# Altium schematic sheet MUX.SchDoc
size B
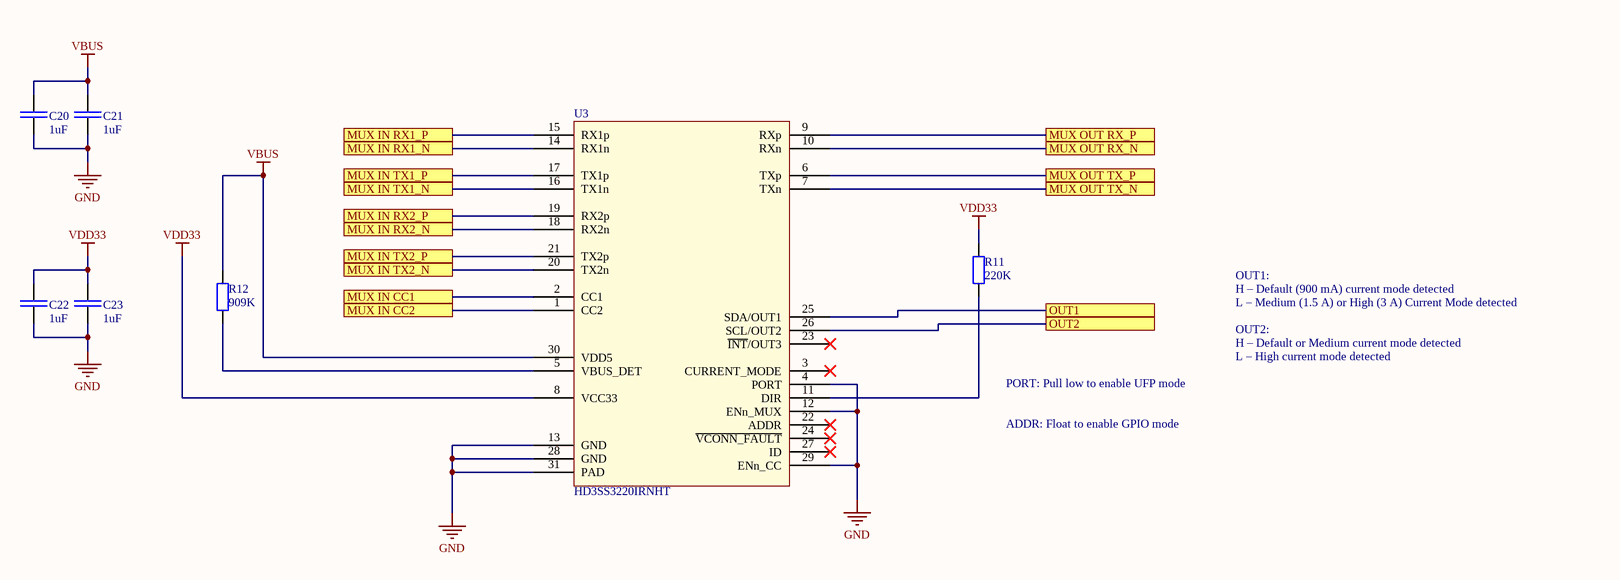
[diagram p0: MUX.SchDoc]

## Parts
C20  1uF  [CAP_SM0805_YAGEOCC2_N]
C21  1uF  [CAP_SM0805_YAGEOCC2_N]
C22  1uF  [CAP_SM0805_YAGEOCC2_N]
C23  1uF  [CAP_SM0805_YAGEOCC2_N]
R11  220K  [RES_SM0603_YAGEORC_N]
R12  909K  [RES_SM0603_YAGEORC_N]
U3  HD3SS3220IRNHT  [QFN40P250X450X80_HS-31N - HD3SS3220IRNHT]

## Ports
MUX IN CC1, MUX IN CC2, MUX IN RX1_N, MUX IN RX1_P, MUX IN RX2_N, MUX IN RX2_P, MUX IN TX1_N, MUX IN TX1_P, MUX IN TX2_N, MUX IN TX2_P, MUX OUT RX_N, MUX OUT RX_P, MUX OUT TX_N, MUX OUT TX_P, OUT1, OUT2

## Nets
GND: C20.2 C21.2 C22.2 C23.2 U3.4(PORT) U3.12(ENn_MUX) U3.13(GND) U3.28(GND) U3.29(ENn_CC) U3.31(PAD)
VBUS: C20.1 C21.1 R12.2 U3.30(VDD5)
VDD33: C22.1 C23.1 R11.2 U3.8(VCC33)
MUX IN CC1: U3.2(CC1) ; port MUX IN CC1
MUX IN CC2: U3.1(CC2) ; port MUX IN CC2
MUX IN RX1_N: U3.14(RX1n) ; port MUX IN RX1_N
MUX IN RX1_P: U3.15(RX1p) ; port MUX IN RX1_P
MUX IN RX2_N: U3.18(RX2n) ; port MUX IN RX2_N
MUX IN RX2_P: U3.19(RX2p) ; port MUX IN RX2_P
MUX IN TX1_N: U3.16(TX1n) ; port MUX IN TX1_N
MUX IN TX1_P: U3.17(TX1p) ; port MUX IN TX1_P
MUX IN TX2_N: U3.20(TX2n) ; port MUX IN TX2_N
MUX IN TX2_P: U3.21(TX2p) ; port MUX IN TX2_P
MUX OUT RX_N: U3.10(RXn) ; port MUX OUT RX_N
MUX OUT RX_P: U3.9(RXp) ; port MUX OUT RX_P
MUX OUT TX_N: U3.7(TXn) ; port MUX OUT TX_N
MUX OUT TX_P: U3.6(TXp) ; port MUX OUT TX_P
OUT1: U3.25(SDA/OUT1) ; port OUT1
OUT2: U3.26(SCL/OUT2) ; port OUT2
NetR11_1: R11.1 U3.11(DIR)
NetR12_1: R12.1 U3.5(VBUS_DET)

Not connected (* = marked no-connect by the designer): U3 3(CURRENT_MODE)* 22(ADDR)* 23(~{INT}/OUT3)* 24(~{VCONN_FAULT})* 27(ID)*

## Notes on the sheet
- OUT1:
- H – Default (900 mA) current mode detected
- L – Medium (1.5 A) or High (3 A) Current Mode detected
- PORT: Pull low to enable UFP mode
- OUT2:
- H – Default or Medium current mode detected
- L – High current mode detected
- ADDR: Float to enable GPIO mode

## Library data of the parts
C20-C23 = CC0805KKX7R8BB105: CAP 1uF SM0805 X7R 25V YAGEO CC2; Tolerance (%): 10; Voltage Rating (Volts): 25; Category: Capacitor; Manufacturer: Yageo; Manufacturer Part Number: CC0805KKX7R8BB105; Package: 0805; Value: 1uF; Supplier Part Number 1: 1458903; Supplier 1: Farnell; ComponentLink1URL: http://www.yageo.com; ComponentLink1Description: Manufacturer Website; Supplier 2: Digi-Key; Supplier Part Number 2: 311-1456-1-ND
R11 = RC0603FR-07220KL: RES 220K SM0603 YAGEO RC_L; Power (Watts): 0.1; Resistance (Ohms): 220000; Tolerance (%): 1; Category: Resistor; Manufacturer: Yageo; Manufacturer Part Number: RC0603FR-07220KL; Package: 0603; Value: 220K; Supplier Part Number 1: 9238760; Supplier 1: Farnell; ComponentLink1URL: http://www.yageo.com; ComponentLink1Description: Manufacturer Website; Supplier 2: Digi-Key; Supplier Part Number 2: 311-220KHRCT-ND
R12 = RC0603FR-07909KL: RES 909K SM0603 YAGEO RC_L; Power (Watts): 0.1; Resistance (Ohms): 909000; Tolerance (%): 1; Category: Resistor; Manufacturer: Yageo; Manufacturer Part Number: RC0603FR-07909KL; Package: 0603; Value: 909K; ComponentLink1URL: http://www.yageo.com; ComponentLink1Description: Manufacturer Website; Supplier 2: Digi-Key; Supplier Part Number 2: 311-909KHRCT-ND
U3 = HD3SS3220IRNHT: USB TYPE-C DRP PORT CONTROLLER W